# EAGLE design match_best (EAGLE 7.2.0)
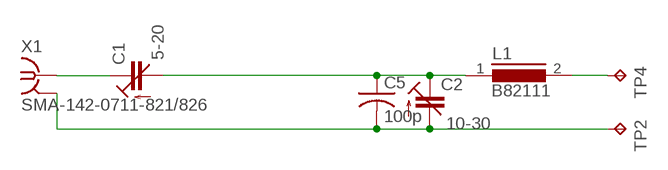
[diagram p0: schematic, sheet 1]

## Parts
C1  5-20  C-TRIMM  [SGC3S]
C2  10-30  C-TRIMM  [SGC3S]
C5  100p  C-US  [1111]
L1  B82111  [SUKW1-30]
TP2  TPPAD1-13Y  [P1-13Y]
TP4  TPPAD1-13Y  [P1-13Y]
X1  SMA-142-0711-821/826  [J502-ND-142-0711-821/826]

## Nets
N$1: C1.P$1(A) C2.P$2(E) C5.P$1 L1.1
N$2: C2.P$1(A) C5.P$2 TP2.TP X1.G@1 X1.G@2 X1.G@3 X1.G@4
N$3: L1.2 TP4.TP
N$7: C1.P$2(E) X1.1

## Library data of the parts
C1 C2 = sprague:C-TRIMM: Trimm capacitor
C5 = resistor:C-US: CAPACITOR, American symbol
L1 = inductors:B82111: INDUCTOR
TP2 TP4 = testpad:TP: Test pad
X1 = con-coax:SMA-: SMA 50 Ohm End Launch Jack Receptacle - Round Contact Johnson Components Source: www.johnsoncomponents.com .. J502-ND.pdf; MF: JOHNSON COMPONENTS; MPN: 142-0711-821; OC_FARNELL: 1019328; OC_NEWARK: 16F3627

## Board
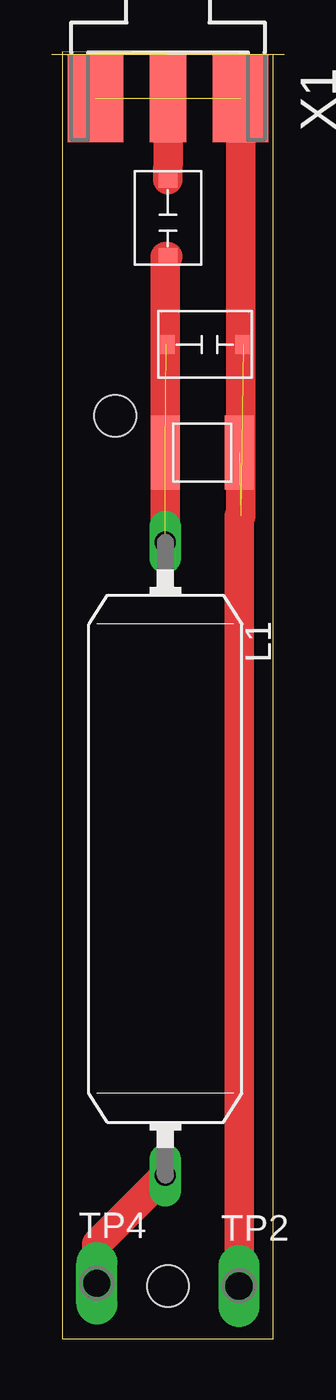
[diagram p1: board, top side]
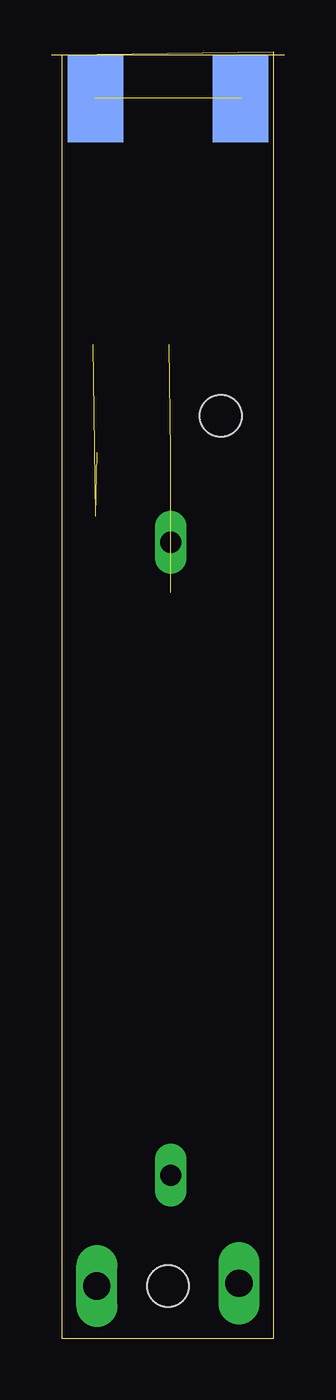
[diagram p2: board, bottom side, seen from below]

Size 10.16 x 61.98 mm. Coordinates in mm from the lower left corner, seen from the top.
Outline: 0,0 10.16,0 10.16,61.85 0,61.98 0,0
Copper layers (1*16): Top 0.035mm / dielectric 1.5mm / Bottom 0.035mm
Design rules "default": minimum track width 10mil, minimum drill 24mil, track to track 8mil, track to pad 8mil, pad to pad 8mil, via to via 8mil, smd to smd 8mil, copper to edge 40mil, drill to drill 8mil, minimum pad ring 10mil, minimum via ring 8mil, stop-mask expansion 4mil, vias tented up to drill 0mil, thermal gap 10mil
Holes 2 mm at 5.08,2.54 2.54,44.45

### Footprints (pad centres in the part's own frame; a part is rotated, then mirrored left to right if it is on the bottom)
SGC3S = smd 0.9 x 0.8: P$1 0,1.85; P$2 0,-1.85
1111 = smd 1.397 x 3.556: P$1 -1.778,0; P$2 1.778,0
SUKW1-30 = drill 1.016 long: 1 -15.24,0; 2 15.24,0
P1-13Y = drill 1.321 pad 1.905 long: TP 0,0
J502-ND-142-0711-821/826 = smd 4.191 x 1.778: 1 2.115,0 | smd 4.191 x 2.667: G@1 2.115,3.495; G@2 2.115,-3.495 | smd 4.191 x 2.667 bottom: G@3 2.115,3.495; G@4 2.115,-3.495

### Placement (x,y rotation side)
C1  5.08,53.98 180 top
C2  6.86,47.88 270 top
C5  6.73,42.67 0 top
L1  4.95,23.11 270 top
TP2  8.51,2.54 0 top
TP4  1.65,2.67 0 top
X1  5.08,61.85 270 top

### Tracks (layer width: path | path; a pad name or v marks a point on that pad's centre or on a via)
N$1  (3 unrouted)
  Top 1.422: C1.P$1 4.95,52.12 L1.1
N$2  (5 unrouted)
  Top 1.422: X1.G@3 8.57,39.63 8.51,39.63 TP2.TP
N$3
  Top 1.422: L1.2 1.65,4.57 TP4.TP
N$7
  Top 1.422: X1.1 5.15,59.73 C1.P$2